# EAGLE design MINI_SAM_D51_rAD1_b002 (EAGLE 9.5.0)
BUILD: 2018/01; DESIGNER: BENJAMIN SHOCKLEY; REV: A
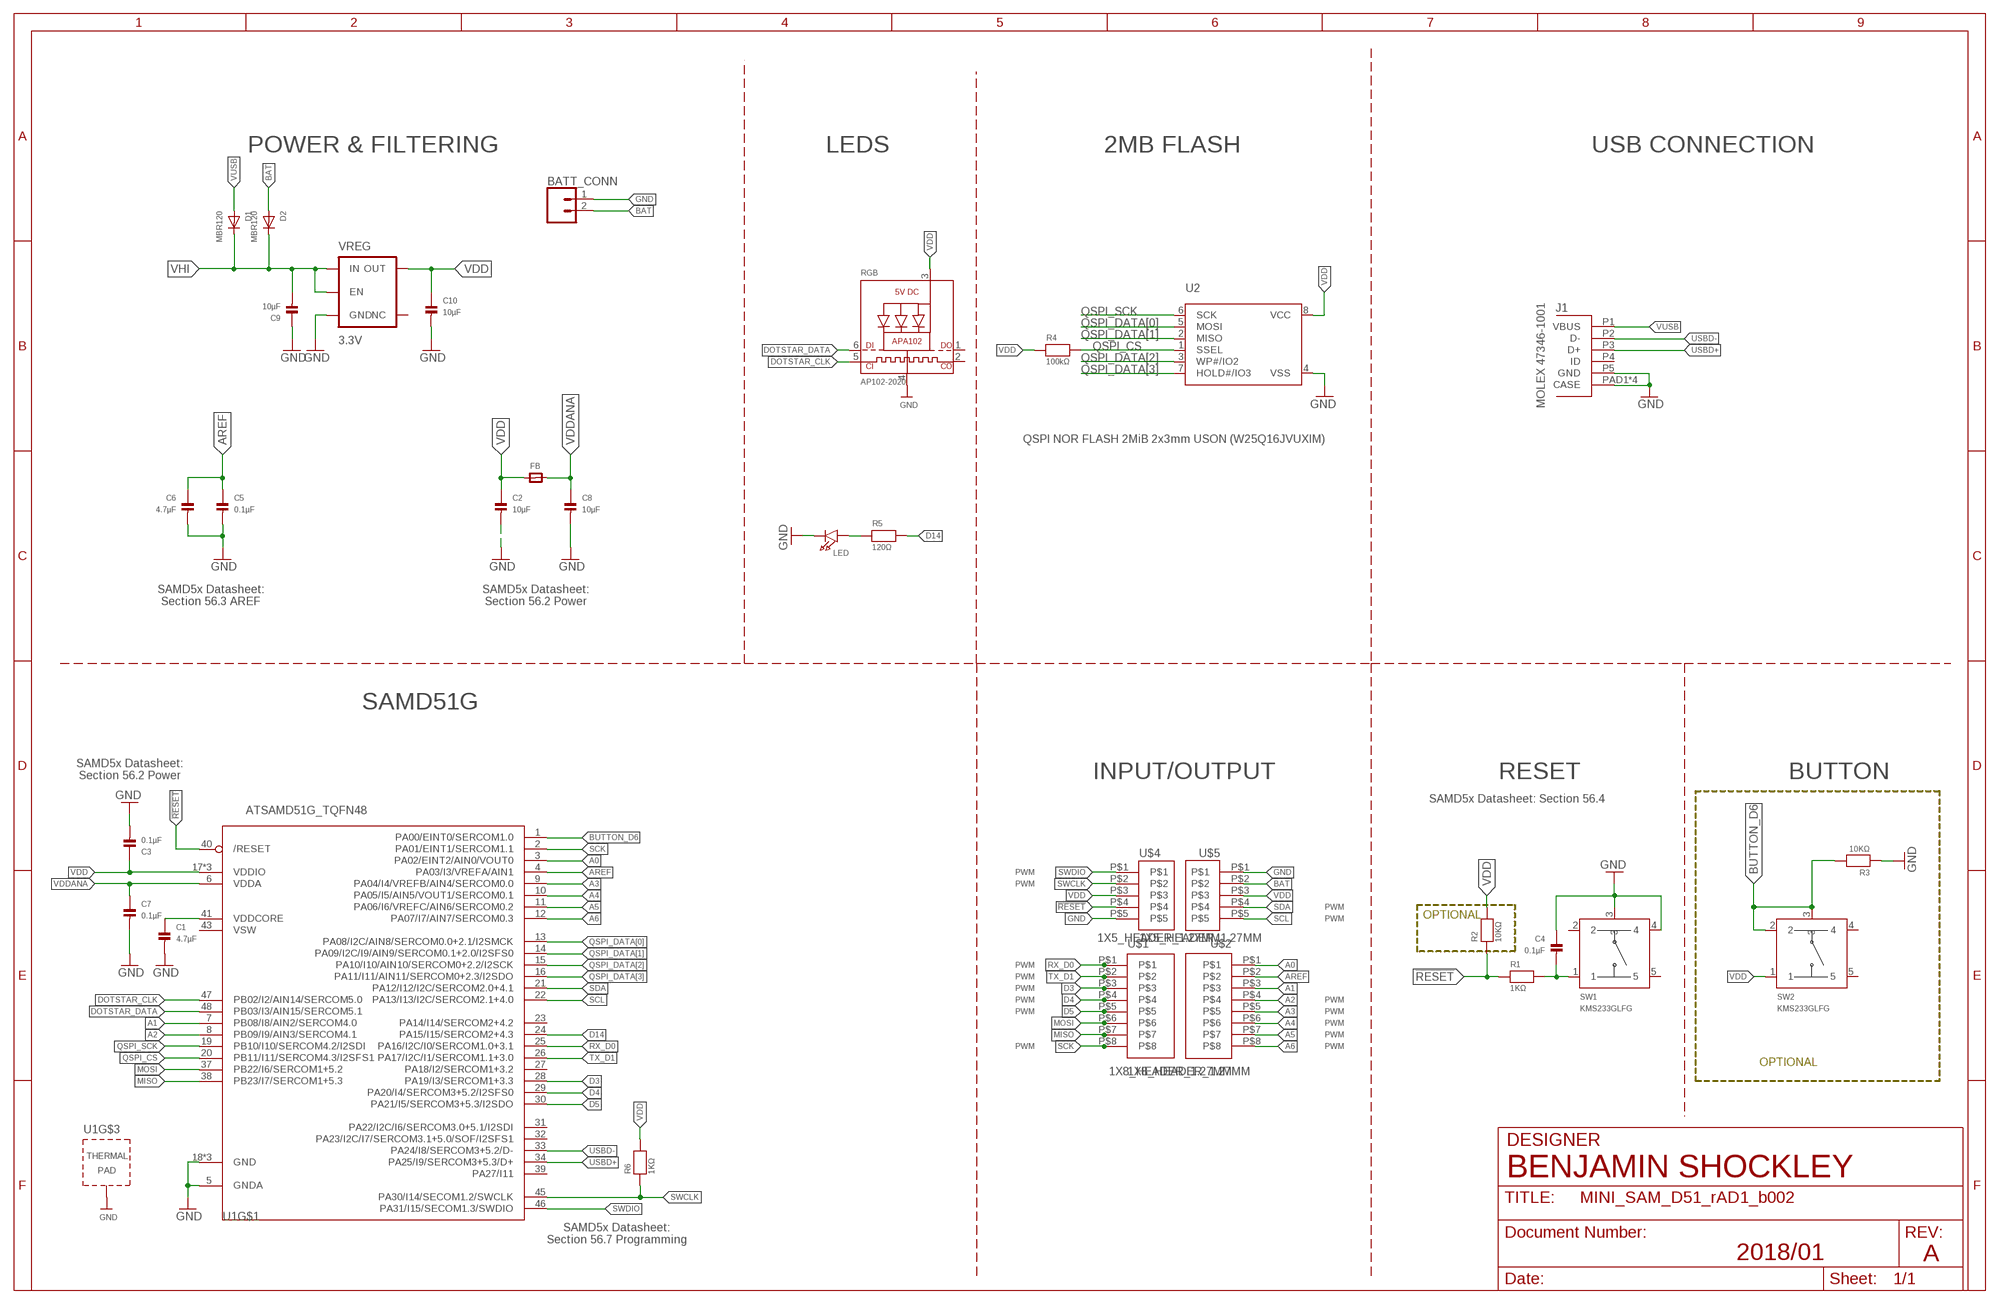
[diagram p0: schematic, sheet 1]

## Parts
BATT_CONN  CONN_02-JST-2MM-SMT  [JST-2-SMD_NO_PASTE]
C1  4.7µF  CAP_CERAMICQUIRKY  [0603_CAPACITOR]
C2  10µF  CAP_CERAMICQUIRKY  [0603_CAPACITOR]
C3  0.1µF  CAP_CERAMICQUIRKY  [0603_CAPACITOR]
C4  0.1µF  CAP_CERAMICQUIRKY  [0603_CAPACITOR]
C5  0.1µF  CAP_CERAMICQUIRKY  [0603_CAPACITOR]
C6  4.7µF  CAP_CERAMICQUIRKY  [0603_CAPACITOR]
C7  0.1µF  CAP_CERAMICQUIRKY  [0603_CAPACITOR]
C8  10µF  CAP_CERAMICQUIRKY  [0603_CAPACITOR]
C9  10µF  CAP_CERAMICQUIRKY  [0603_CAPACITOR]
C10  10µF  CAP_CERAMICQUIRKY  [0603_CAPACITOR]
D1  MBR120  DIODE_SOD-123FL  [SOD-123FL]
D2  MBR120  DIODE_SOD-123FL  [SOD-123FL]
FB  Impedence: 50 ohm @ 20 MHz, 220 Ohm @ 100 MHz; low DC resistance  FERRITEQUIRKY  [0603_INDUCTOR]
J1  MOLEX_47346-100147346  [MOLEX_47346-1001]
LED  VLRK31Q1R2-GS08  REVERSEMOUNTLED  [REVERSE_MOUNT_LED]
R1  1KΩ  RESISTORQUIRKY  [0603_RESISTOR]
R2  10KΩ  RESISTORQUIRKY  [0603_RESISTOR]
R3  10KΩ  RESISTORQUIRKY  [0603_RESISTOR]
R4  100kΩ  RESISTORQUIRKY  [0603_RESISTOR]
R5  120Ω  RESISTORQUIRKY  [0603_RESISTOR]
R6  1KΩ  RESISTORQUIRKY  [0603_RESISTOR]
RGB  AP102-2020  APA1022020  [APA102_2020]
SW1  KMS233GLFG  KMS_SWITCHKMS  [KMS_SWITCH]
SW2  KMS233GLFG  KMS_SWITCHKMS  [KMS_SWITCH]
U1  ATSAMD51G_TQFN48  [TQFN48_7MM]
U2  QSPI NOR FLASH 2MiB 2x3mm USON (W25Q16JVUXIM)  SPIFLASH_8PINUX  [USON8]
U$1  1X8_HEADER_1.27MM  [1X8_HEADER_1.27MM]
U$2  1X8_HEADER_1.27MM  [1X8_HEADER_1.27MM]
U$4  1X5_HEADER_1.27MM  [1X5_HEADER_1.27MM]
U$5  1X5_HEADER_1.27MM  [1X5_HEADER_1.27MM]
VREG  3.3V  V_REG_AP2112K-3.3V  [SOT23-5]

## Nets
!RESET: R1.1 R2.1 U1.40(/RESET) U$4.P$4
A0: U1.3(PA02/EINT2/AIN0/VOUT0) U$2.P$1
A1: U1.7(PB08/I8/AIN2/SERCOM4.0) U$2.P$3
A2: U1.8(PB09/I9/AIN3/SERCOM4.1) U$2.P$4
A3: U1.9(PA04/I4/VREFB/AIN4/SERCOM0.0) U$2.P$5
A4: U1.10(PA05/I5/AIN5/VOUT1/SERCOM0.1) U$2.P$6
A5: U1.11(PA06/I6/VREFC/AIN6/SERCOM0.2) U$2.P$7
A6: U1.12(PA07/I7/AIN7/SERCOM0.3) U$2.P$8
AREF: C5.1 C6.1 U1.4(PA03/I3/VREFA/AIN1) U$2.P$2
BAT: BATT_CONN.2 D2.A U$5.P$2
BUTTON_D6: R3.2 SW2.2 SW2.3 U1.1(PA00/EINT0/SERCOM1.0)
D3: U1.28(PA19/I3/SERCOM1+3.3) U$1.P$3
D4: U1.29(PA20/I4/SERCOM3+5.2/I2SFS0) U$1.P$4
D5: U1.30(PA21/I5/SERCOM3+5.3/I2SDO) U$1.P$5
D14: R5.2 U1.24(PA15/I15/SERCOM2+4.3)
DOTSTAR_CLK: RGB.5(CKI) U1.47(PB02/I2/AIN14/SERCOM5.0)
DOTSTAR_DATA: RGB.6(DI) U1.48(PB03/I3/AIN15/SERCOM5.1)
GND: BATT_CONN.1 C1.2 C2.2 C3.2 C4.1 C5.2 C6.2 C7.2 C8.2 C9.1 C10.2 J1.P5(GND) J1.PAD1(CASE) J1.PAD2(CASE) J1.PAD3(CASE) J1.PAD4(CASE) LED.C R3.1 RGB.4(GND) SW1.3 SW1.4 U1.5(GNDA) U1.18(GND) U1.35(GND) U1.42(GND) U1.THERMAL(TP) U2.4(VSS) U$4.P$5 U$5.P$1 VREG.2(GND)
MISO: U1.38(PB23/I7/SERCOM1+5.3) U$1.P$7
MOSI: U1.37(PB22/I6/SERCOM1+5.2) U$1.P$6
N$3: LED.A R5.1
N$4: C4.2 R1.2 SW1.1
N$9: C1.1 U1.41(VDDCORE)
QSPI_CS: R4.2 U1.20(PB11/I11/SERCOM4.3/I2SFS1) U2.1(SSEL)
QSPI_DATA[0]: U1.13(PA08/I2C/AIN8/SERCOM0.0+2.1/I2SMCK) U2.5(MOSI)
QSPI_DATA[1]: U1.14(PA09/I2C/I9/AIN9/SERCOM0.1+2.0/I2SFS0) U2.2(MISO)
QSPI_DATA[2]: U1.15(PA10/I10/AIN10/SERCOM0+2.2/I2SCK) U2.3(WP#/IO2)
QSPI_DATA[3]: U1.16(PA11/I11/AIN11/SERCOM0+2.3/I2SDO) U2.7(HOLD#/IO3)
QSPI_SCK: U1.19(PB10/I10/SERCOM4.2/I2SDI) U2.6(SCK)
RX_D0: U1.25(PA16/I2C/I0/SERCOM1.0+3.1) U$1.P$1
SCK: U1.2(PA01/EINT1/SERCOM1.1) U$1.P$8
SCL: U1.22(PA13/I13/I2C/SERCOM2.1+4.0) U$5.P$5
SDA: U1.21(PA12/I12/I2C/SERCOM2.0+4.1) U$5.P$4
SWCLK: R6.1 U1.45(PA30/I14/SECOM1.2/SWCLK) U$4.P$2
SWDIO: U1.46(PA31/I15/SECOM1.3/SWDIO) U$4.P$1
TX_D1: U1.26(PA17/I2C/I1/SERCOM1.1+3.0) U$1.P$2
USBD+ [USB_DATA]: J1.P3(D+) U1.34(PA25/I9/SERCOM3+5.3/D+)
USBD- [USB_DATA]: J1.P2(D-) U1.33(PA24/I8/SERCOM3+5.2/D-)
VDD: C2.1 C3.1 C10.1 FB.1 R2.2 R4.1 R6.2 RGB.3(VDD) SW2.1 U1.17(VDDIO) U1.36(VDDIO) U1.44(VDDIO) U2.8(VCC) U$4.P$3 U$5.P$3 VREG.5(OUT)
VDDANA: C7.1 C8.1 FB.2 U1.6(VDDA)
VHI: C9.2 D1.C D2.C VREG.1(IN) VREG.3(EN)
VUSB: D1.A J1.P1(VBUS)
Unconnected: J1.P4(ID) RGB.1(DO) RGB.2(CKO) SW1.2 SW1.5 SW2.4 SW2.5 U1.23(PA14/I14/SERCOM2+4.2) U1.27(PA18/I2/SERCOM1+3.2) U1.31(PA22/I2C/I6/SERCOM3.0+5.1/I2SDI) U1.32(PA23/I2C/I7/SERCOM3.1+5.0/SOF/I2SFS1) U1.39(PA27/I11) VREG.4(NC)

## Notes on the sheet
- POWER & FILTERING | LEDS | 2MB FLASH | USB CONNECTION
- MOLEX 47346-1001
- SAMD5x Datasheet:
  Section 56.3 AREF
- SAMD5x Datasheet:
  Section 56.2 Power
- SAMD51G
- SAMD5x Datasheet:
  Section 56.2 Power
- INPUT/OUTPUT | RESET | BUTTON
- SAMD5x Datasheet: Section 56.4
- SPI:
   SERCOM1  SCK.1, MOSI.2, MISO.3
  
  I2C:
   SERCOM2  SDA.0, SCL.1
  
  UART:
   SERCOM3  TX.0, RX.1
- PWM
- PWM
- PWM
- OPTIONAL
- PWM
- PWM
- PWM
- PWM
- PWM | PWM
- PWM | PWM
- PWM
- PWM
- PWM | PWM
- OPTIONAL
- DESIGNER
- SAMD5x Datasheet:
  Section 56.7 Programming

## Power pins joined to a net without a drawn wire
VSW: U1.43(VSW)

## Library data of the parts
BATT_CONN = MINI_SAM_D51_r023_b001:CONN_02: Multi connection point. Often used as Generic Header-pin footprint for 0.1 inch spaced/style header connections On any of the 0.1 inch spaced packages, you can populate with these: Break Away Headers - Straight <https://www.sparkfun.com/products/116> (PRT-00116) Break Away Male Headers - Right Angle <https://www.sparkfun.com/products/553> (PRT-00553) Female Headers <https://www.sparkfun.com/products/115> (PRT-00115) Break Away Headers - Machine Pin <https://www.sparkfun.com/products/117> (PRT-00117) Break Away Female Headers - Swiss Machine Pin <https://www.sparkfun.com/products/743> (PRT-00743) For SCREWTERMINALS and SPRING TERMINALS visit here: Screw Terimnals on SparkFun.com <https://www.sparkfun.com/search/results?term=Screw+Terminals> (5mm/3.5mm/2.54mm spacing) This device is also useful as a general connection point to wire up your design to another part of your project. Our various solder wires solder well into these plated through hole pads. Hook-Up Wire - Assortment (Stranded, 22 AWG) <https://www.sparkfun.com/products/11375> (PRT-11375) Hook-Up Wire - Assortment (Solid Core, 22 AWG) <https://www.sparkfun.com/products/11367> (PRT-11367) View the entire wire category on our website here <https://www.sparkfun.com/categories/141> Special notes: Molex polarized connector foot print use with: PRT-08233 with associated crimp pins and housings. 2.54_SCREWTERM for use with PRT-10571. 3.5mm Screw Terminal footprints for PRT-08084 5mm Screw Terminal footprints for use with PRT-08432; PROD_ID: CONN-13512; SF_ID: PRT-09918; SF_SKU: PRT-08432; SKU: PRT-09914
C1-C10 = MINI_SAM_D51_r023_b001:CAP_CERAMIC: Ceramic Capacitors 0402 - 0402 Surface Mount Capacitors 16pF 50V 5% [Digikey: 445-4899-2-ND] 18pF 50V 5% [Digikey: 490-1281-2-ND] 22pF 50V 5% [Digikey: 490-1283-2-ND] 68pF 50V 5% [Digikey: 490-1289-2-ND] 0.1uF 10V 10% [Digikey: 490-1318-2-ND] 1.0uF 6.3V 10% [Digikey: 490-1320-2-ND] 0603 - 0603 Surface Mount Capacitors 16 pF 50V 5% [Digikey: 445-5051-2-ND] 22 pF 50V [Digikey: PCC220ACVTR-ND] 33 pF 50V 5% [Digikey: 490-1415-1-ND] 56pF 50V 5% [Digikey: 490-1421-1-ND] 220pF 50V 5% [Digikey: 445-1285-1-ND] 680 pF 50V 2200 pF 50V 5% C0G [Digikey: 445-1297-1-ND] 5600 pF 100V 5% X7R [Digikey: 478-3711-1-ND] 0.1 µF 25V 10% [Digikey: PCC2277TR-ND] 0.22 µF 16V 10% X7R [Digikey: 445-1318-1-ND] 1.0 µF 25V 10% [Digikey: 445-5146-2-ND] 0603 - RF Specific 3pF 250V +/-0.1pF RF [Digikey: 712-1347-1-ND] 18 pF 250V 5% [Digikey: 478-3505-1-ND or 712-1322-1-ND] 56 pF 250V 5% C0G RF [Digikey: 490-4867-1-ND] 68 pF 250V RF [Digikey: 490-4868-1-ND] 0805 - 0805 Surface Mount Capacitors 220 pF 250V 2% RF Ceramic Capacitor [Digikey: 712-1398-1-ND] 1000 pF 50V 2% NP0 Ceramic Capacitor [Digikey: 478-3760-1-ND] 0.1 µF 25V 10% Ceramic Capacitor [Digikey: PCC1828TR-ND] 1.0 µF 16V 10% Ceramic Capacitor[Digikey: 490-1691-2-ND] 10.0 µF 10V 10% Ceramic Capacitor[Digikey: 709-1228-1-ND] 10.0 uF 16V 10% Ceramic Capacitor [Digikey: 478-5165-2-ND] 47 uF 6.3V 20% Ceramic Capacitor [Digikey: 587-1779-1-ND or 399-5506-1-ND] 1206 - 1206 Surface Mount Capacitors 47uF 10V 20% Ceramic Capacitor [Digikey: 490-5528-1-ND or 399-5508-1-ND or 445-6010-1-ND] 100uF 6.3V -20%, +80% Y5V Ceramic Capacitor (Digikey: 490-4512-1-ND, Mouser: 81-GRM31CF50J107ZE1L)
D1 D2 = MINI_SAM_D51_r023_b001:DIODE: Diode SMADIODE - SMA Surface Mount Package 20V 1A Schottky Diode Digikey: 641-1014-6-ND DO-1N4148 - Through Hole Small Current Diode SOD-123 20V 1 A (.5mV Vf) Schottky Diode - Digikey: MBRX120TPMSCT-ND SOD-323 10V 570mA (.38mV Vf, 3ns) Schottky Diode - Digikey: ZLLS410CT-ND SOD-523 30V 30mA Schottky Diode (RB751S-40TE61) - Digikey: RB751S-40TE61CT-ND SOT23-R/W - SOT23 Package (R = Solder Paste/Reflow Ovens, W = Hand-Soldering) BAT54Film 40V 300mA - Digikey: 497-7162-1-ND
FB = MINI_SAM_D51_r023_b001:FERRITE: Ferrite Bead 0603 MMZ1608B121C - 120 Ohm @ 100MHz, 600mA, 0.15 Ohm DC Resistance - Digikey: 445-2164-1-ND BK1608HW121-T - 120 Ohm, 600mA Ferrite Chip - Digikey: 587-1876-2-ND 0805 HZ0805B272R-10 - 2.7K Ohm @ 100MHz, 200mA, 0.8 Ohm DC Resistance - Digikey: 240-2504-1-ND (see also Murata BLM21BD272SN1L) MMZ2012Y152B - 1.5K Ohm @ 100MHz, 500mA, 0.4 Ohm DC Resistance - Digikey: 445-1560-1-ND - Mainly for high frequency (80-400MHz) MMZ2012R102A - 1K Ohm @ 100MHz, 500mA, 0.3 Ohm DC Resistance - Digikey: 445-1555-2-ND - More general purpose (10-200MHz)
J1 = Shockley_Custom:MOLEX_47346-1001
LED = MINI_SAM_D51_r023_b001:REVERSEMOUNTLED
R1-R6 = MINI_SAM_D51_r023_b001:RESISTOR: Resistors 0402 - 0402 Surface Mount Package 22 Ohm 1% 1/16W [Digikey: 311-22.0LRTR-ND] 33 Ohm 5% 1/16W 1.0K 5% 1/16W 1.5K 5% 1/16W 2.0K 1% 1/16W 10.0K 1% 1/16W [Digikey: 311-10.0KLRTR-ND] 10.0K 5% 1/16W [Digikey: RMCF0402JT10K0TR-ND] 12.1K 1% 1/16W [Digikey: 311-22.0LRTR-ND] 100.0K 5% 1/16W 0603 - 0603 Surface Mount Package 0 Ohm 1/10 Watt 1% Resistor 15 Ohm 1/10 Watt 1% Resistor 33 Ohm 1/10 Watt 1% Resistor 49.9 Ohm 1/10 Watt 1% Resistor 100 Ohm 1/10 Watt 1% Resistor 150 Ohm 1/10 Watt 1% Resistor 240 Ohm 1/10 Watt 1% Resistor 390 Ohm 1/10 Watt 1% Resistor 560 Ohm 1/10 Watt 1% Resistor 680 Ohm 1/10 Watt 1% Resistor 750 Ohm 1/10 Watt 1% Resistor 1.0K Ohm 1/10 Watt 1% Resistor 1.5K Ohm 1/10 Watt 1% Resistor 2.0K Ohm 1/10 Watt 1% Resistor 2.2K Ohm 1/10 Watt 1% Resistor 3.3K Ohm 1/10 Watt 1% Resistor 4.7K Ohm 1/10 Watt 1% Resistor 10.0K Ohm 1/10 Watt 1% Resistor 12.0K Ohm 1/10 Watt 1% Resistor 12.1K Ohm 1/10 Watt 1% Resistor 20.0K Ohm 1/10 Watt 1% Resistor 33.0K Ohm 1/10 Watt 1% Resistor 100.0K Ohm 1/10 Watt 1% Resistor 0805 - 0805 Surface Mount Package 0 Ohm 1/8 Watt 1% Resistor 33 Ohm 1/8 Watt 1% Resistor 100 Ohm 1/8 Watt 1% Resistor 150 Ohm 1/8 Watt 1% Resistor 200 Ohm 1/8 Watt 1% Resistor 240 Ohm 1/8 Watt 1% Resistor 330 Ohm 1/8 Watt 1% Resistor 390 Ohm 1/8 Watt 1% Resistor 470 Ohm 1/8 Watt 1% Resistor 1.0K Ohm 1/8 Watt 1% Resistor 1.5K Ohm 1/8 Watt 1% Resistor 2.0K Ohm 1/8 Watt 1% Resistor 4.7K Ohm 1/8 Watt 1% Resistor 5.1K Ohm 1/8 Watt 1% Resistor 5.6K Ohm 1/8 Watt 1% Resistor 10.0K Ohm 1/8 Watt 1% Resistor 22.0K Ohm 1/8 Watt 1% Resistor 33.0K Ohm 1/8 Watt 1% Resistor 100K Ohm 1/8 Watt 1% Resistor 1206 - 1206 Surface Mount Package 2012 - 2010 Surface Mount Package 0.11 Ohm 1/2 Watt 1% Resistor - Digikey: RHM.11UCT-ND
RGB = microbuilder:APA102: APA102/DotStar Pixels VCC: 5V DC Refresh Rate: 400Hz
SW1 SW2 = Shockley_Custom:KMS_SWITCH
U1 = microbuilder:ATSAMD51G
U2 = MINI_SAM_D51_r023_b001:SPIFLASH_8PIN: SOIC8 SPI Flash Be careful with the size since SOIC8 flash comes in several 'widths' SOIC8 150 mil M25P16 - 16Mbit (2Mbit x 8) Serial Flash (75MHz SPI Bus), Supply: 2.7-3.6V Digikey: SOIC8 - M25P16-VMN6P-ND SOIC8 208 mil W25Q16BVSSIG - 16Mbit (2Mbit x 8) Serial Flash (104MHz SPI Bus), Supply: 2.7-3.6V Digikey: SOIC8 - W25Q16BVSSIG-ND
U$1 U$2 = Shockley_Custom:1X8_HEADER_1.27MM
U$4 U$5 = Shockley_Custom:1X5_HEADER_1.27MM
VREG = MINI_SAM_D51_r023_b001:V_REG_AP2112: AP2112 - 600mA CMOS LDO Regulator w/ Enable The AP2112 is CMOS process low dropout linear regulator with enable function, the regulator delivers a guaranteed 600mA (min.) continuous load current. Features Output Voltage Accuracy: ±1.5% Output Current: 600mA (Min.) Foldback Short Current Protection: 50mA Enable Function to Turn ON/OFF VOUT Low Dropout Voltage (3.3V): 250mV (Typ.) @IOUT=600mA Excellent Load Regulation: 0.2%/A (Typ.) Excellent Line Regulation: 0.02%/V (Typ.) Low Quiescent Current: 55μA (Typ.) Low Standby Current: 0.01μA (Typ.) Low Output Noise: 50μVRMS PSRR: 100Hz -65dB, 1kHz -65dB OTSD Protection Stable with 1.0μF Flexible Cap: Ceramic, Tantalum and Aluminum Electrolytic Operation Temperature Range: -40°C to 85°C ESD: MM 400V, HBM 4000V; PROD_ID: VREG-12457

## Board
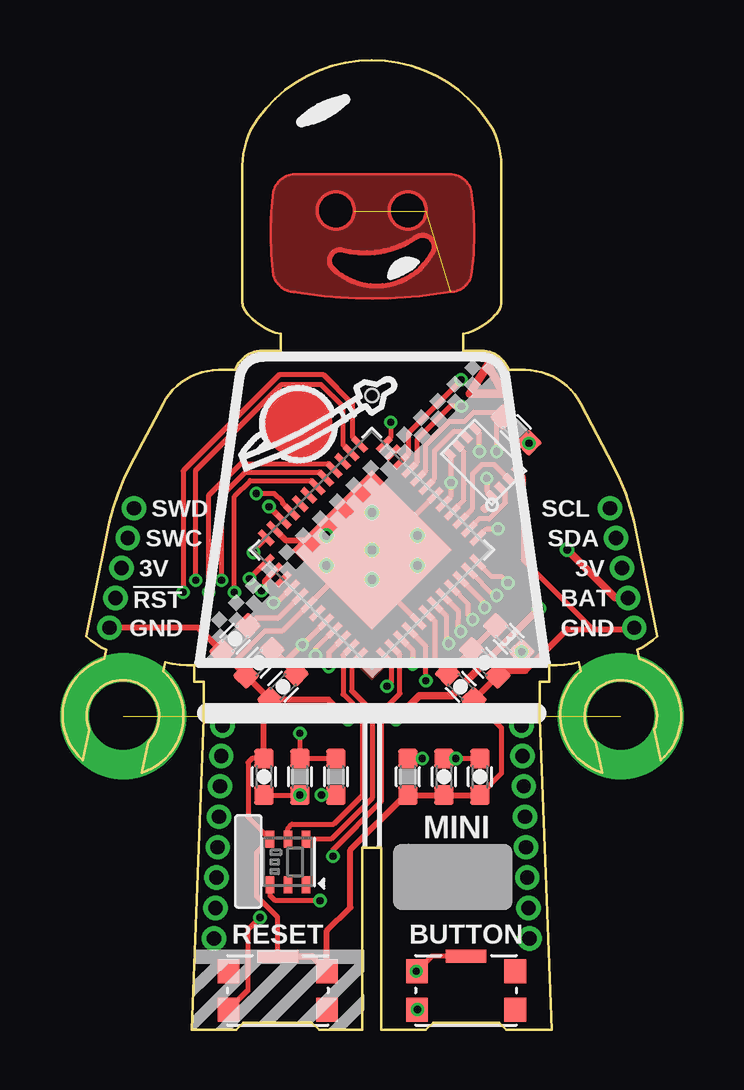
[diagram p1: board, top side]
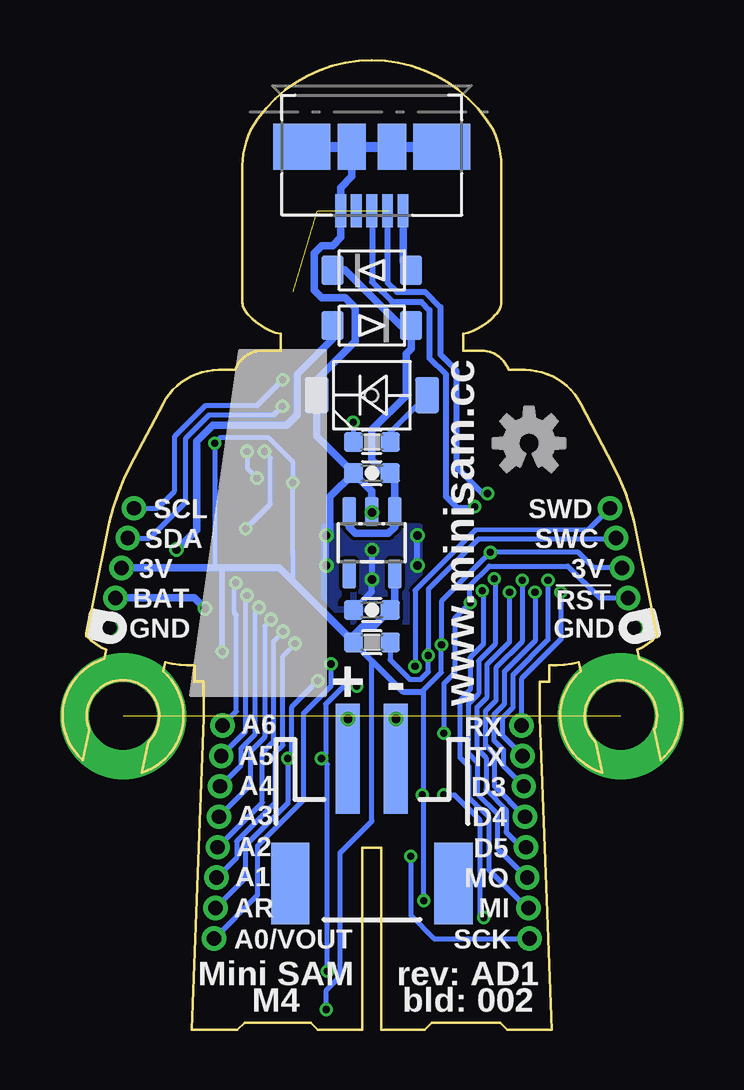
[diagram p2: board, bottom side, seen from below]

Size 25.78 x 40.42 mm. Coordinates in mm from the lower left corner, seen from the top.
Outline: 7.74,29.8 arc-40 7.49,30.3 7.49,36 arc-25 7.84,37.5 arc-120 17.94,37.5 arc-25 18.29,36 18.29,30.3 arc-40 18.04,29.8 arc-35 16.69,29 16.69,28.3 17.57,28.3 arc-63 18.59,27.5 19.27,27.5 arc-62 21.59,26.1 22.95,23.5 arc-18 23.95,20.54 24.79,16.4 arc-15 23.95,15.83 24.03,15.46 arc-122 24.93,11.24 24.66,12.52 arc125 22.95,14.54 arc125 22.21,12 22.48,10.72 arc-122 21.59,14.95 21.51,15.31 arc-15 20.29,15.2 20.29,14.5 19.89,14.5 19.89,13 20.39,0 18.49,0 18.19,0.3 15.44,0.3 15.14,0 13.29,0 13.29,7.6 12.49,7.6 12.49,0 10.69,0 10.39,0.3 7.54,0.3 7.24,0 5.39,0 5.89,13 5.89,14.5 5.49,14.5 5.49,15.2 arc-15 4.27,15.31 4.19,14.95 arc-122 3.29,10.72 3.56,12 arc125 2.83,14.54 arc125 1.12,12.52 0.85,11.24 arc-122 1.75,15.46 1.82,15.83 arc-15 0.99,16.4 1.83,20.54 arc-18 2.82,23.5 4.19,26.1 arc-62 6.5,27.5 7.19,27.5 arc-63 8.21,28.3 9.09,28.3 9.09,29 arc-35 7.74,29.8
Copper layers (1*16): Top 0.035559375mm / dielectric 1.6mm / Bottom 0.035559375mm
Design rules "oshpark-2layer-tented *": minimum track width 6mil, minimum drill 0.3mm, track to track 6mil, track to pad 6mil, pad to pad 6mil, via to via 6mil, smd to smd 6mil, copper to edge 0.5mil, drill to drill 6mil, minimum pad ring 5mil, minimum via ring 5mil, stop-mask expansion 2.5mil, vias tented up to drill 20mil, thermal gap 10mil
Holes 0.55 mm at 12.9,26.44
tRestrict: area 11.3,31.2 to 15.2,32.9; area 14,33.8 to 14.8,34.5; area 12.4,25.9 to 13.6,26.9; area 13.5,26.8 to 13.6,26.9; area 11,33.8 to 11.8,34.5; 5 lines
bRestrict: area 12.4,25.9 to 13.7,27

### Footprints (pad centres in the part's own frame; a part is rotated, then mirrored left to right if it is on the bottom)
JST-2-SMD_NO_PASTE = smd 1 x 4.6: 1 -1,-3.7; 2 1,-3.7 | smd 1.6 x 3.4: NC1 -3.4,1.5; NC2 3.4,1.5
0603_CAPACITOR = smd 0.8 x 0.8: 1 -0.762,0; 2 0.762,0
SOD-123FL = smd 0.91 x 1.22: A 1.637,0; C -1.637,0
0603_INDUCTOR = smd 0.8 x 0.8: 1 -0.762,0; 2 0.762,0
MOLEX_47346-1001 = smd 0.45 x 1.38: P1 1.3,-2.66; P2 0.65,-2.66; P3 0,-2.66; P4 -0.65,-2.66; P5 -1.3,-2.66 | smd 2.375 x 1.9: PAD1 -2.913,0; PAD4 2.913,0 | smd 1.175 x 1.9: PAD2 -0.838,0; PAD3 0.838,0
REVERSE_MOUNT_LED = smd 1 x 1.5: A 2.3,0; C -2.3,0
0603_RESISTOR = smd 0.8 x 0.8: 1 -0.762,0; 2 0.762,0
APA102_2020 = smd 0.7 x 0.35: 1 -0.95,-0.75; 2 -0.95,0; 3 -0.95,0.75; 4 0.95,0.75; 5 0.95,0; 6 0.95,-0.75
KMS_SWITCH = smd 0.9 x 1: 1 -2.05,-0.8; 2 -2.05,0.8; 4 2.05,0.8; 5 2.05,-0.8 | smd 1.7 x 0.55: 3 0,1.425
TQFN48_7MM = smd 0.25 x 0.75: 1 -2.75,-3.475; 2 -2.25,-3.475; 3 -1.75,-3.475; 4 -1.25,-3.475; 5 -0.75,-3.475; 6 -0.25,-3.475; 7 0.25,-3.475; 8 0.75,-3.475; 9 1.25,-3.475; 10 1.75,-3.475; 11 2.25,-3.475; 12 2.75,-3.475; 25 2.75,3.475; 26 2.25,3.475; 27 1.75,3.475; 28 1.25,3.475; 29 0.75,3.475; 30 0.25,3.475; 31 -0.25,3.475; 32 -0.75,3.475; 33 -1.25,3.475; 34 -1.75,3.475; 35 -2.25,3.475; 36 -2.75,3.475 | smd 0.75 x 0.25: 13 3.475,-2.75; 14 3.475,-2.25; 15 3.475,-1.75; 16 3.475,-1.25; 17 3.475,-0.75; 18 3.475,-0.25; 19 3.475,0.25; 20 3.475,0.75; 21 3.475,1.25; 22 3.475,1.75; 23 3.475,2.25; 24 3.475,2.75; 37 -3.475,2.75; 38 -3.475,2.25; 39 -3.475,1.75; 40 -3.475,1.25; 41 -3.475,0.75; 42 -3.475,0.25; 43 -3.475,-0.25; 44 -3.475,-0.75; 45 -3.475,-1.25; 46 -3.475,-1.75; 47 -3.475,-2.25; 48 -3.475,-2.75 | smd 4.7 x 4.7: THERMAL 0,0
USON8 = smd 0.5 x 0.3: 1 -1.25,0.75; 2 -1.25,0.25; 3 -1.25,-0.25; 4 -1.25,-0.75; 5 1.25,-0.75; 6 1.25,-0.25; 7 1.25,0.25; 8 1.25,0.75
1X8_HEADER_1.27MM = drill 0.6 pad 1.016: P$1 -4.445,0; P$2 -3.175,0; P$3 -1.905,0; P$4 -0.635,0; P$5 0.635,0; P$6 1.905,0; P$7 3.175,0; P$8 4.445,0
1X5_HEADER_1.27MM = drill 0.6 pad 1.016: P$1 -2.54,0; P$2 -1.27,0; P$3 0,0; P$4 1.27,0; P$5 2.54,0
SOT23-5 = smd 0.55 x 1.2: 1 -0.95,-1.3; 2 0,-1.3; 3 0.95,-1.3; 4 0.95,1.3; 5 -0.95,1.3

### Placement (x,y rotation side)
BATT_CONN  12.89,7.6 180 bottom
C1  7.19,16.3 225 top
C2  8.19,15.3 225 top
C3  9.19,14.3 225 top
C4  8.39,10.55 270 top
C5  15.89,10.55 270 top
C6  17.39,10.55 270 top
C7  16.59,14.3 315 top
C8  17.59,15.3 315 top
C9  12.89,23.2 0 bottom
C10  12.89,17.5 180 bottom
D1  12.89,31.65 0 bottom
D2  12.89,29.35 180 bottom
FB  18.59,16.3 135 top
J1  12.89,36.8 0 bottom
LED  12.89,26.45 0 bottom
R1  9.89,10.55 270 top
R2  11.39,10.55 270 top
R3  14.39,10.55 90 top
R4  18.89,25 135 top
R5  12.89,24.5 180 bottom
R6  12.89,16.15 180 bottom
RGB  9.39,7 90 top
SW1  8.96,1.65 0 top
SW2  16.81,1.65 0 top
U1  12.89,20 45 top
U2  17.54,23.65 135 top
U$1  6.49,8.25 267.8 top
U$2  19.29,8.25 92.2 top
U$3  [OSHW-LOGO-S]  6.34,24.45 0 bottom
U$4  2.46,19.25 258.5 top
U$5  23.31,19.25 101.5 top
VREG  12.89,20.3 180 bottom

### Tracks (layer width: path | path; a pad name or v marks a point on that pad's centre or on a via)
!RESET  (via drill 0.3)
  Top 0.203: U1.40 8.92,17.8 v8.79,17.8 | R2.1 R1.1 v9.89,12.36
  Bottom 0.203: U$4.P$4 3.39,18 4.72,19.33 8.01,19.33 8.82,18.52 8.82,18.08 8.79,18.05 v8.79,17.8 9.44,17.15 9.44,14.88 9.89,14.43 v9.89,12.36
A0  (via drill 0.3)
  Top 0.203: U1.3 14.59,15.82 v14.59,15.25
  Bottom 0.203: U$2.P$1 17.66,5.61 17.66,7.66 15.73,9.59 15.73,13.2 14.59,14.34 v14.59,15.25
A1  (via drill 0.3)
  Top 0.203: U1.7 15.98,17.26 15.98,16.21 v16.09,16.1
  Bottom 0.203: v16.09,16.1 16.6,15.59 16.6,11.87 16.93,11.54 16.93,9.45 18.52,7.86 18.52,7.18 U$2.P$3
A2  (via drill 0.3)
  Top 0.203: U1.8 16.48,17.47 16.47,16.72 v16.59,16.6
  Bottom 0.203: v16.59,16.6 16.97,16.22 16.97,12.04 17.45,11.55 17.45,9.47 U$2.P$4
A3  (via drill 0.3)
  Top 0.203: U1.9 16.89,17.77 16.89,17.3 v17.09,17.1
  Bottom 0.203: U$2.P$5 17.93,10.22 17.93,11.62 17.36,12.19 17.36,16.83 v17.09,17.1
A4  (via drill 0.3)
  Top 0.203: U1.10 17.59,17.77 v17.59,17.6
  Bottom 0.203: U$2.P$6 18.34,11.03 18.34,11.73 17.76,12.31 17.76,17.43 v17.59,17.6
A5  (via drill 0.3)
  Top 0.203: U1.11 17.97,18.1 v18.09,18.1
  Bottom 0.203: U$2.P$7 18.17,12.42 18.17,18.02 v18.09,18.1
A6  (via drill 0.3)
  Top 0.203: v18.56,18.63 18.3,18.89 17.89,18.89 U1.12
  Bottom 0.203: U$2.P$8 18.54,13.27 18.54,17.3 18.62,17.38 18.62,18.57 v18.56,18.63
AREF  (via drill 0.3)
  Top 0.203: C6.1 v16.39,11.31 C5.1 | v15.14,14.55 15.14,15.98 U1.4
  Bottom 0.203: v15.14,14.55 16.24,13.45 16.24,11.46 v16.39,11.31 16.39,9.45 18.17,7.67 18.17,6.32 U$2.P$2
BAT  (via drill 0.35)
  Top 0.305: v13.89,12.95 14.86,13.92 16.21,13.92 v19.85,17.56 | U$5.P$2 23.03,18 v21.03,20.01
  Bottom 0.305: D2.A 14.53,28.81 16.01,27.33 16.01,25.63 16.44,25.2 19.52,25.2 20.19,24.53 20.19,20.85 v21.03,20.01 | BATT_CONN.2 v13.89,12.95 | U$5.P$2 20.29,18 v19.85,17.56
BUTTON_D6  (via drill 0.3)
  Top 0.203: v13.52,14.32 13.7,14.51 13.7,15.3 U1.1 | SW2.3 15.39,3.08 SW2.2 v14.74,2.45 | R3.2 v14.99,11.31
  Bottom 0.203: v13.52,14.32 14.07,14.32 14.82,13.57 14.82,11.48 v14.99,11.31 14.74,11.06 v14.74,2.45
D3  (via drill 0.3)
  Top 0.203: U1.28 | U1.28 11.06,23.6 7.42,23.6 6.09,22.27 v6.09,18.24
  Bottom 0.203: U$1.P$3 7.4,10.99 7.4,11.65 7.79,12.05 7.79,13.15 7.37,13.58 7.37,14.94 6.09,16.22 v6.09,18.24
D4  (via drill 0.3)
  Top 0.203: U1.29 10.71,23.24 7.61,23.24 6.62,22.25 v6.62,18.74
  Bottom 0.203: U$1.P$4 7.78,10.15 7.78,11.48 8.15,11.86 8.15,13.3 7.73,13.72 7.73,15.08 6.62,16.18 v6.62,18.74
D5  (via drill 0.3)
  Top 0.203: U1.30 10.35,22.89 7.81,22.89 7.16,22.24 v7.16,18.24
  Bottom 0.203: U$1.P$5 6.66,7.62 7.29,8.24 7.29,9.16 8.13,10 8.13,11.34 8.51,11.71 8.51,13.45 8.08,13.87 8.08,15.23 7.16,16.15 v7.16,18.24
D14  (via drill 0.3)
  Top 0.203: v13.67,25.32 13.67,24.68 13.4,24.41 U1.24
  Bottom 0.203: R5.2 13.67,24.52 v13.67,25.32
DOTSTAR_CLK
  Top 0.203: RGB.5 9.39,8.39 9.55,8.57 11.3,8.57 12.49,9.76 12.49,13.18 11.69,13.98 11.69,15.62 U1.47
DOTSTAR_DATA
  Top 0.203: RGB.6 11.19,7.95 12.89,9.66 12.89,13.28 12.04,14.13 12.04,15.27 U1.48
GND  (via drill 0.35)
  Top 0.203: SW1.3 8.96,4.71 8.09,5.58 8.09,7.4 RGB.4 7.73,8.85 7.73,11.15 7.9,11.31 C4.1 | C7.2 18.29,12.6 18.29,10.69 C6.2 | U1.42 9.15,16.62 8.43,16.62 7.12,15.31 7.1,15.31 | U1.5 13.06,18.77 v12.89,18.77 | U1.18 13.89,20.65 13.89,20 | U2.4 19.19,23.06 19.19,19.6 22.09,16.7
  Top 0.254: U1.35 9.31,20.4 10.79,20.4 v10.99,20.6 11.59,20 U1.THERMAL | U1.THERMAL 12.24,19.35 v10.99,19.35 11.09,19.25 11.09,18.55 U1.42 | U1.THERMAL 13.89,20 14.19,20 v14.79,20.6 | C3.2 C2.2 7.1,15.31 C1.2 5.65,16.76 U$4.P$5 | C4.1 8.39,13.5 C3.2 | v11.89,12.95 11.08,13.76 C3.2 | SW1.3 10.39,3.08 SW1.4 11.01,4.12 11.99,5.1 11.99,7.5 14.28,9.79 R3.1 C5.2 C6.2 | C7.2 C8.2 18.32,14.96 19.28,14.96 21.03,16.7 22.09,16.7 23.76,16.7 U$5.P$1
  Bottom 0.152: 12.89,22 VREG.2 v12.89,21.56
  Bottom 0.203: BATT_CONN.1 v11.89,12.95
  Bottom 0.254: LED.C 15.19,27.09 | C10.2 12.89,18.26 v12.89,18.77 U1.THERMAL | v10.99,19.35 v10.99,20.6 | v14.79,19.35 v14.79,20.6 14.64,20.75
  Bottom 0.305: C9.1 12.89,22.44 12.89,22 | LED.C 15.19,24.74 C9.1 | 15.19,27.09 13.59,28.69 13.59,30.1 13.99,30.5 14.97,30.5 15.29,30.82 15.29,32.36 14.97,32.68 14.53,32.68 14.19,33.02 J1.P5 14.19,35.1 13.73,35.56 J1.PAD2 | C9.1 14.64,22.21 14.64,20.75
  Bottom 0.406: J1.PAD4 J1.PAD3 J1.PAD2 J1.PAD1
  other vias: 12.89,20
  pour Bottom: 10.89,20.98 14.89,20.98 14.89,17.02 10.89,17.02
GND3  (via drill 2.8 pad 5.25)  (1 unrouted)
  other vias: 2.52,13.08 23.26,13.08
MISO  (via drill 0.3)
  Top 0.203: v8.29,18.3 8.42,18.43 8.42,18.71 U1.38
  Bottom 0.203: U$1.P$7 6.39,5.05 8.02,6.68 8.02,8.88 8.84,9.71 8.84,10.98 9.22,11.35 9.22,13.74 8.79,14.17 8.79,15.52 8.24,16.08 8.24,18.25 v8.29,18.3
MOSI  (via drill 0.3)
  Top 0.203: U1.37 8.48,19.49 v7.79,18.8
  Bottom 0.203: U$1.P$6 6.43,6.35 7.66,7.58 7.66,9.03 8.49,9.85 8.49,11.13 8.86,11.51 8.86,13.6 8.44,14.02 8.44,15.38 7.75,16.07 7.75,18.76 v7.79,18.8
N$1
  Top 0.35: 17.71,27.71 18.38,26.51 16.96,26.51 17.71,27.7
N$3
  Bottom 0.203: LED.A 12.13,24.91 R5.1
N$4  (via drill 0.3)
  Top 0.203: v8.23,4.69 7.72,4.18 7.72,1.65 SW1.1 | C4.2 R1.2
  Bottom 0.203: v8.23,4.69 8.37,4.84 8.37,8.73 9.43,9.79 R1.2
  other vias: 9.89,9.79
N$9
  Top 0.203: U1.41 9.28,17.45 9.28,17.44 8.99,17.15 8.04,17.15 C1.1
N$12  (2 unrouted)
  Top 0.1: 9.69,30.75 arc-76 8.79,31.45 arc-15 8.79,34.95 arc-76 9.69,35.65 16.14,35.65 arc-76 17.04,34.95 arc-15 17.04,31.45 arc-76 16.14,30.75 | 9.62,30.76 arc20 16.17,30.76
  Top 0.15: 15.16,34.12 arc-356 15.16,34.17 | 12.16,34.12 arc-356 12.16,34.17
  Top 0.2: 11.24,31.75 arc105 15.39,32.35 arc167 14.69,33 arc-46 11.64,32.5 arc142 11.24,31.75
  pour Top: 12.89,35.63 9.62,35.63 arc45 9.07,35.4 9.06,35.39 arc45 8.76,34.67 8.68,33.81 8.67,32.84 8.72,32.08 8.79,31.44 8.86,31.26 8.98,31.07 9.11,30.95 9.26,30.85 9.42,30.79 9.63,30.74 10.72,30.6 11.57,30.51 12.31,30.48 12.89,30.47 12.89,31.06
  pour Top: 12.91,35.64 16.18,35.65 16.35,35.63 16.62,35.52 16.77,35.39 16.94,35.19 17.04,34.92 17.12,34.1 17.15,33.37 17.14,32.77 17.11,32.05 17.03,31.44 16.88,31.13 16.77,31 16.51,30.83 16.21,30.76 15.93,30.72 15.28,30.63 14.29,30.53 13.67,30.49 12.95,30.47
QSPI_CS  (via drill 0.3)
  Top 0.203: U2.1 17.68,22.45 v17.68,22.99 | v18.09,24.1 18.09,25.28 R4.2 18.15,25.74 17.13,25.74 16.75,25.36 16.14,25.36 15.14,24.36 15.14,23.31 U1.20
  Bottom 0.203: v18.09,24.1 18.09,23.4 v17.68,22.99
QSPI_DATA[0]  (via drill 0.3)
  Top 0.203: v17.37,24.1 17.37,24.88 U2.5 | U1.13 17.66,20.88 v18.14,20.88
  Bottom 0.203: v17.37,24.1 17.11,23.85 17.11,21.91 v18.14,20.88
QSPI_DATA[1]
  Top 0.203: U2.2 18.45,22.39 18.45,21.96 17.78,21.29 17.36,21.29 U1.14
QSPI_DATA[2]
  Top 0.203: U1.15 17.09,21.73 17.09,23.18 17.48,23.57 17.97,23.57 U2.3
QSPI_DATA[3]
  Top 0.203: U1.16 16.73,22.07 16.73,22.75 16.73,24.11 U2.7
QSPI_SCK
  Top 0.203: U1.19 15.5,22.97 15.5,24.13 16.33,24.95 16.59,24.95 U2.6
RX_D0  (via drill 0.3)
  Top 0.203: v5.02,18.24 5.02,23.29 9.03,27.3 10.88,27.3 12.08,26.1 12.08,24.7 U1.25
  Bottom 0.203: v5.02,18.24 5.02,16.27 6.66,14.63 U$1.P$1
SCK  (via drill 0.3)
  Top 0.203: U1.2 14.06,15.65 14.06,14.02 13.3,13.26 13.3,9.55 11.27,7.52 v11.27,7.24
  Bottom 0.203: v11.27,7.24 11.27,4.77 10.31,3.81 U$1.P$8
SCL  (via drill 0.3)
  Top 0.203: U1.22 14.43,24.01 14.43,24.89 16.6,27.06 v16.6,27.09
  Bottom 0.203: v16.6,27.09 17.68,26.01 19.84,26.01 21.11,24.74 21.11,22.45 21.82,21.74 U$5.P$5
SDA  (via drill 0.3)
  Top 0.203: U1.21 14.78,23.66 14.78,24.61 16.16,25.99 v16.62,25.99
  Bottom 0.203: v16.62,25.99 16.99,25.62 19.68,25.62 20.65,24.65 20.65,21.99 22.15,20.5 U$5.P$4
SWCLK  (via drill 0.3)
  Top 0.203: U1.45 10.54,15.88 v10.54,15.6
  Bottom 0.203: U$4.P$2 2.75,20.46 8.44,20.46 10.54,18.37 v10.54,15.6 10.54,14.92 10.85,14.61 11.32,14.61 12.13,15.42 R6.1
SWDIO  (via drill 0.3)
  Top 0.203: U1.46 11.09,15.72 v11.09,15.15
  Bottom 0.203: v11.09,15.15 11.09,18.32 8.59,20.82 3.88,20.83 U$4.P$1
TX_D1  (via drill 0.3)
  Top 0.203: U1.26 11.69,24.38 11.69,25.96 10.75,26.9 9.13,26.9 5.55,23.32 v5.55,18.74
  Bottom 0.203: U$1.P$2 7.44,12.25 7.44,13.01 7.01,13.43 7.01,14.79 5.55,16.25 v5.55,18.74
U1_PIN_1_INDICATOR
  pour Top: 12.89,14.6 13.39,15.1 12.39,15.1
USBD+  (via drill 0.3)
  Top 0.254: U1.34 v8.61,21.81
  Bottom 0.254: J1.P3 12.88,34.13 12.88,31.16 12.05,30.33 10.83,30.33 10.49,30 10.49,28 9.81,27.32 9.81,22.23 9.33,21.76 8.66,21.76 v8.61,21.81
USBD-  (via drill 0.3)
  Top 0.203: U1.33 9.16,21.96 9.16,22.02 8.83,22.35 v8.07,22.35
  Bottom 0.254: v8.07,22.35 8.27,22.35 9.38,23.46 9.38,27.49 10.04,28.15 10.04,30.12 10.67,30.75 11.85,30.75 12.24,31.14 J1.P2
VDD  (via drill 0.3)
  Top 0.203: v19.44,24.45 | R4.1 v19.44,24.45 | U2.8 16.19,23.94 v16.19,22.8 16.19,22.24 U1.17 | SW2.1 v14.79,0.85 | U1.36 7.95,19.98 v7.95,19.9 | v10.73,5.39 8.87,5.39 8.64,5.62 RGB.3 | v10.79,9.79 R2.2
  Top 0.254: U1.44 v9.99,16.05 9.25,15.31
  Top 0.305: C2.1 9.25,15.31 C3.1
  Bottom 0.203: v10.73,5.39 10.73,9.3 | 10.73,9.3 10.73,9.73 v10.79,9.79 10.74,9.84 10.74,14.15 | 10.79,14.1 10.74,14.15 | 10.74,14.15 9.99,14.9 v9.99,16.05 9.99,17.86 v7.95,19.9 4.29,19.9 3.64,19.25 U$4.P$3 | v14.79,0.85 14.79,1.65 14.21,2.23 14.21,7.38 12.88,8.7 12.88,15.38 | 10.73,9.3 | 16.19,19.86 16.19,20 | 16.19,20 v16.19,22.8 16.19,23.67 17.21,24.69 19.19,24.69 v19.44,24.45 19.44,19.25 19.89,19.25 | 16.19,20 16.19,18.69
  Bottom 0.254: R6.2 12.88,15.38 11.6,14.1 10.79,14.1 | 19.11,19.25 19.13,19.25 FB.1
  Bottom 0.305: VREG.5 11.94,17.7 C10.1 12.84,16.8 13.29,16.8 13.65,16.44 R6.2 | R6.2 13.5,16.14 | R6.2 16.19,18.69 16.75,19.25 19.11,19.25 19.89,19.25 U$5.P$3
  other vias: 19.13,15.76
VDDANA
  Top 0.203: U1.6 15.51,17.04 15.51,15.38 C7.1
  Top 0.254: FB.2 C8.1 C7.1
VHI
  Bottom 0.305: VREG.3 13.84,20.95 13.58,20.69 12.2,20.69 11.94,20.95 VREG.1 11.94,23.04 C9.2 12.37,23.23 12.89,23.75 12.89,25 11.46,26.43 11.46,28.17 11.25,28.38 D2.C 11.7,29.35 14.02,31.67 D1.C
VUSB
  Bottom 0.305: J1.P1 11.59,32.01 D1.A
(copper drawn outside any net)
  shapes: Top circle x2

### Text on the board
bPlace: SWD | SCL | SWC | SDA | 3V | 3V | !RST | BAT | GND | GND | - | + | RX | A6 | TX | A5 | D3 | A4 | D4 | A3 | D5 | A2 | MO | A1 | MI | AR | SCK | A0/VOUT
tNames: SWD | SCL | SWC | SDA | 3V | 3V | !RST | BAT | GND | GND | MINI | RESET | BUTTON
bNames: www.minisam.cc | rev: AD1 / bld: 002 | Mini SAM / M4
tStop: STATUS | SAM | D51
tDocu: MEM
bDocu: µUSB | LED | R5